# EAGLE design ReflowToasterOven (EAGLE 5.11)
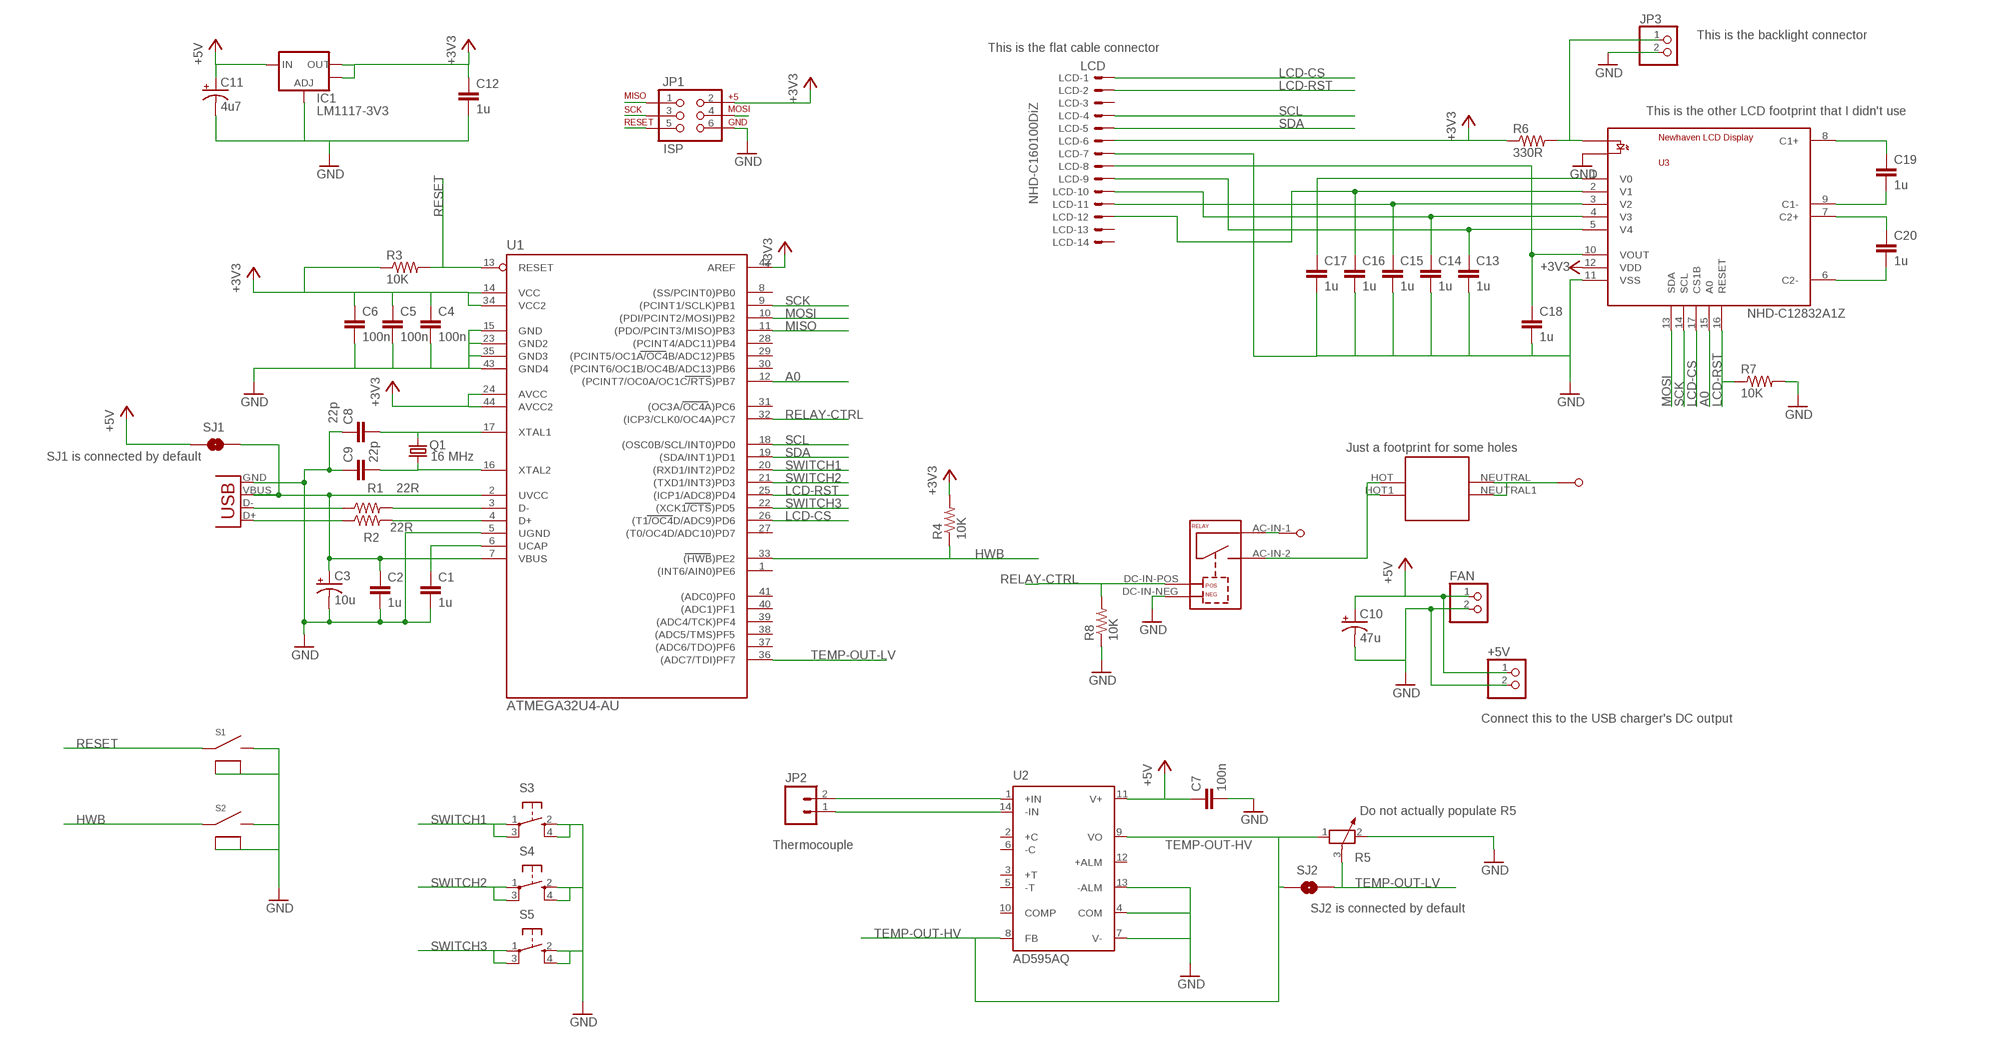
[diagram p0: schematic, sheet 1]

## Parts
+5V  PINHD-1X2  [1X02]
C1  1u  C-EUC0805  [C0805]
C2  1u  C-EUC0805  [C0805]
C3  10u  CPOL-USSMCB  [SMC_B]
C4  100n  C-EUC0805  [C0805]
C5  100n  C-EUC0805  [C0805]
C6  100n  C-EUC0805  [C0805]
C7  100n  C-EUC0805  [C0805]
C8  22p  C-EUC0805  [C0805]
C9  22p  C-EUC0805  [C0805]
C10  47u  CPOL-USD  [PANASONIC_D]
C11  4u7  CPOL-USSMCB  [SMC_B]
C12  1u  C-EUC0805  [C0805]
C13  1u  C-EUC0805  [C0805]
C14  1u  C-EUC0805  [C0805]
C15  1u  C-EUC0805  [C0805]
C16  1u  C-EUC0805  [C0805]
C17  1u  C-EUC0805  [C0805]
C18  1u  C-EUC0805  [C0805]
C19  1u  C-EUC0805  [C0805]
C20  1u  C-EUC0805  [C0805]
FAN  PINHD-1X2  [1X02]
IC1  LM1117-3V3  V_REG_LM1117SOT223  [SOT223]
JP1  ISP  AVR_SPI_PRG_6NS  [2X3-NS]
JP2  M023.5MM  [SCREWTERMINAL-3.5MM-2]
JP3  PINHD-1X2  [1X02]
LCD  LCD  52745-1490  [52745-1490]
Q1  16 MHz  CRYSTALSM49  [SM49]
R1  22R  R-US_R0805  [R0805]
R2  22R  R-US_R0805  [R0805]
R3  10K  R-US_R0805  [R0805]
R4  10K  R-US_R0805  [R0805]
R5  POTENTIOMETER_PT-10  [PT-10]
R6  330R  R-US_R0805  [R0805]
R7  10K  R-US_R0805  [R0805]
R8  10K  R-US_R0805  [R0805]
RELAY  SOLID-STATE-RELAY  [SSR]
S1  SWITCH-TACT-SIDE-1TL3330  [SWITCH-TACT-SIDE-1]
S2  SWITCH-TACT-SIDE-1TL3330  [SWITCH-TACT-SIDE-1]
S3  TAC_SWITCHSMD-7.2  [TACT-BTN-7.2MM]
S4  TAC_SWITCHSMD-7.2  [TACT-BTN-7.2MM]
S5  TAC_SWITCHSMD-7.2  [TACT-BTN-7.2MM]
SJ1  SOLDERJUMPERNO  [SJ_2S-NO]
SJ2  SOLDERJUMPERNO  [SJ_2S-NO]
U1  ATMEGA32U4-AU  [TQFP44]
U2  AD595AQ  AD595  [DIL14]
U3  NHD-LCD  [NHD-LCD]
USB  USBSMD  [USB-MINIB]
X1  PLUG-THINGY  [MINI-CHARGER]
X3  PAD  PADPTH-LARGE  [PAD-LARGE]
X5  PAD  PADPTH-LARGE  [PAD-LARGE]

## Nets
+3V3: C4.1 C5.1 C6.1 C12.1 IC1.2(OUT) IC1.4(OUT) JP1.2 LCD.6 R3.1 R4.2 R6.1 U1.14(VCC) U1.24(AVCC) U1.34(VCC2) U1.42(AREF) U1.44(AVCC2) U3.12(VDD)
+5V: +5V.1 C7.1 C10.+ C11.+ FAN.1 IC1.3(IN) SJ1.1 U2.11(V+)
A0: U1.12((PCINT7/OC0A/OC1C/RTS)PB7) U3.15(A0)
GND: +5V.2 C1.2 C2.2 C3.- C4.2 C5.2 C6.2 C7.2 C8.1 C9.1 C10.- C11.- C12.2 C13.2 C14.2 C15.2 C16.2 C17.2 C18.2 FAN.2 IC1.1(ADJ) JP1.6 JP3.2 LCD.7 R5.2 R7.2 R8.1 RELAY.DC-IN-NEG S1.2 S1.S1 S1.S2 S2.2 S2.S1 S2.S2 S3.2 S3.4 S4.2 S4.4 S5.2 S5.4 U1.5(UGND) U1.15(GND) U1.23(GND2) U1.35(GND3) U1.43(GND4) U2.4(COM) U2.7(V-) U2.13(-ALM) U3.11(VSS) U3.K(LED-K) USB.GND
HWB: R4.1 S2.1 U1.33((HWB)PE2)
LCD-CS: LCD.1 U1.26((T1/OC4D/ADC9)PD6) U3.17(CS1B)
LCD-RST: LCD.2 R7.1 U1.25((ICP1/ADC8)PD4) U3.16(RESET)
MISO: JP1.1 U1.11((PDO/PCINT3/MISO)PB3)
MOSI: JP1.4 U1.10((PDI/PCINT2/MOSI)PB2) U3.13(SDA)
N$1: R1.1 USB.D-
N$2: R2.1 USB.D+
N$3: C2.1 C3.+ SJ1.2 U1.2(UVCC) U1.7(VBUS) USB.VBUS
N$4: C1.1 U1.6(UCAP)
N$5: R1.2 U1.3(D-)
N$6: R2.2 U1.4(D+)
N$7: C8.2 Q1.2 U1.17(XTAL1)
N$8: C9.2 Q1.1 U1.16(XTAL2)
N$9: RELAY.AC-IN-2 X1.HOT X1.HOT1
N$10: JP3.1 R6.2 U3.A(LED-A)
N$11: JP2.2 U2.1(+IN)
N$12: JP2.1 U2.14(-IN)
N$13: X1.NEUTRAL X1.NEUTRAL1 X3.P$1
N$14: RELAY.AC-IN-1 X5.P$1
N$15: C17.1 U3.1(V0)
N$16: C16.1 LCD.12 U3.2(V1)
N$17: C15.1 LCD.11 U3.3(V2)
N$18: C14.1 LCD.10 U3.4(V3)
N$19: C13.1 LCD.9 U3.5(V4)
N$20: C18.1 LCD.8 U3.10(VOUT)
N$21: C19.1 U3.8(C1+)
N$22: C19.2 U3.9(C1-)
N$23: C20.1 U3.7(C2+)
N$24: C20.2 U3.6(C2-)
RELAY-CTRL: R8.2 RELAY.DC-IN-POS U1.32((ICP3/CLK0/OC4A)PC7)
RESET: JP1.5 R3.2 S1.1 U1.13(RESET)
SCK: JP1.3 U1.9((PCINT1/SCLK)PB1) U3.14(SCL)
SCL: LCD.4 U1.18((OSC0B/SCL/INT0)PD0)
SDA: LCD.5 U1.19((SDA/INT1)PD1)
SWITCH1: S3.1 S3.3 U1.20((RXD1/INT2)PD2)
SWITCH2: S4.1 S4.3 U1.21((TXD1/INT3)PD3)
SWITCH3: S5.1 S5.3 U1.22((XCK1/CTS)PD5)
TEMP-OUT-HV: R5.1 SJ2.1 U2.8(FB) U2.9(VO)
TEMP-OUT-LV: R5.3 SJ2.2 U1.36((ADC7/TDI)PF7)
Unconnected: LCD.3 LCD.13 LCD.14 U1.1((INT6/AIN0)PE6) U1.8((SS/PCINT0)PB0) U1.27((T0/OC4D/ADC10)PD7) U1.28((PCINT4/ADC11)PB4) U1.29((PCINT5/OC1A/OC4B/ADC12)PB5) U1.30((PCINT6/OC1B/OC4B/ADC13)PB6) U1.31((OC3A/OC4A)PC6) U1.37((ADC6/TDO)PF6) U1.38((ADC5/TMS)PF5) U1.39((ADC4/TCK)PF4) U1.40((ADC1)PF1) U1.41((ADC0)PF0) U2.2(+C) U2.3(+T) U2.5(-T) U2.6(-C) U2.10(COMP) U2.12(+ALM)

## Notes on the sheet
- This is the backlight connector
- This is the flat cable connector
- This is the other LCD footprint that I didn't use
- NHD-C160100DiZ
- NHD-C12832A1Z
- SJ1 is connected by default | Just a footprint for some holes
- Connect this to the USB charger's DC output
- Do not actually populate R5
- Thermocouple
- SJ2 is connected by default

## Library data of the parts
+5V FAN JP3 = pinhead:PINHD-1X2: PIN HEADER
C1 C2 C4-C9 C12-C20 = rcl:C-EU: CAPACITOR, European symbol
C3 C10 C11 = rcl:CPOL-US: POLARIZED CAPACITOR, American symbol
IC1 = SparkFun:V_REG_LM1117: Voltage Regulator LM1117 Standard adjustable voltage regulator but in SMD form. Spark Fun Electronics SKU : COM-00595
JP1 = ReflowToasterOven:AVR_SPI_PRG_6: AVR ISP 6 Pin This is the reduced ISP connector for AVR programming. Common on Arduino. This footprint will take up less PCB space and can be used with a 10-pin to 6-pin adapter such as SKU: BOB-08508
JP2 = ReflowToasterOven:M02: Header 2 Standard 2-pin 0.1" header. Use with straight break away headers (SKU : PRT-00116), right angle break away headers (PRT-00553), swiss pins (PRT-00743), machine pins (PRT-00117), and female headers (PRT-00115). Molex polarized connector foot print use with SKU : PRT-08233 with associated crimp pins and housings.
LCD = con-molex:52745-1490: FFC/FPC-to-Board 0.50mm (.020") SMT Top Contact Right Angle, ZIF, Style Receptacle 52745 / 52435 Source: http://www.molex.com/product/ffc/52745.html
Q1 = crystal:CRYSTAL: CRYSTAL
R1-R4 R6-R8 = rcl:R-US_: RESISTOR, American symbol
R5 = rcl:POTENTIOMETER_: Potentiometer
RELAY = ReflowToasterOven:SOLID-STATE-RELAY
S1 S2 = ReflowToasterOven:SWITCH-TACT-SIDE-1
S3-S5 = ReflowToasterOven:TAC_SWITCH: Momentary Switch Button commonly used for reset or general input. Spark Fun Electronics SKU : COM-00097
SJ1 SJ2 = ReflowToasterOven:SOLDERJUMPER: Solder Jumper Standard SMD solder jumper. Used to automate production. Two varients : Normally Open and Normally Closed are the same, but have different paste layers. NC will have a large amount of paste and should jumper during reflow.
U1 = ReflowToasterOven:ATMEGA32U4-AU
U2 = analog-devices:AD595: ANALOG DEVICES
U3 = ReflowToasterOven:NHD-LCD
USB = ReflowToasterOven:USB: USB Connectors USB-B-PTH is fully proven SKU : PRT-00139 USB-miniB is fully proven SKU : PRT-00587 USB-A-PCB is untested. USB-A-H is throughly reviewed, but untested. Spark Fun Electronics SKU : PRT-00437 USB-B-SMT is throughly reviewed, but untested. Needs silkscreen touching up. USB-A-S has not been used/tested USB-MB-H has not been used/tested
X1 = ReflowToasterOven:PLUG-THINGY
X3 X5 = ReflowToasterOven:PAD

## Board
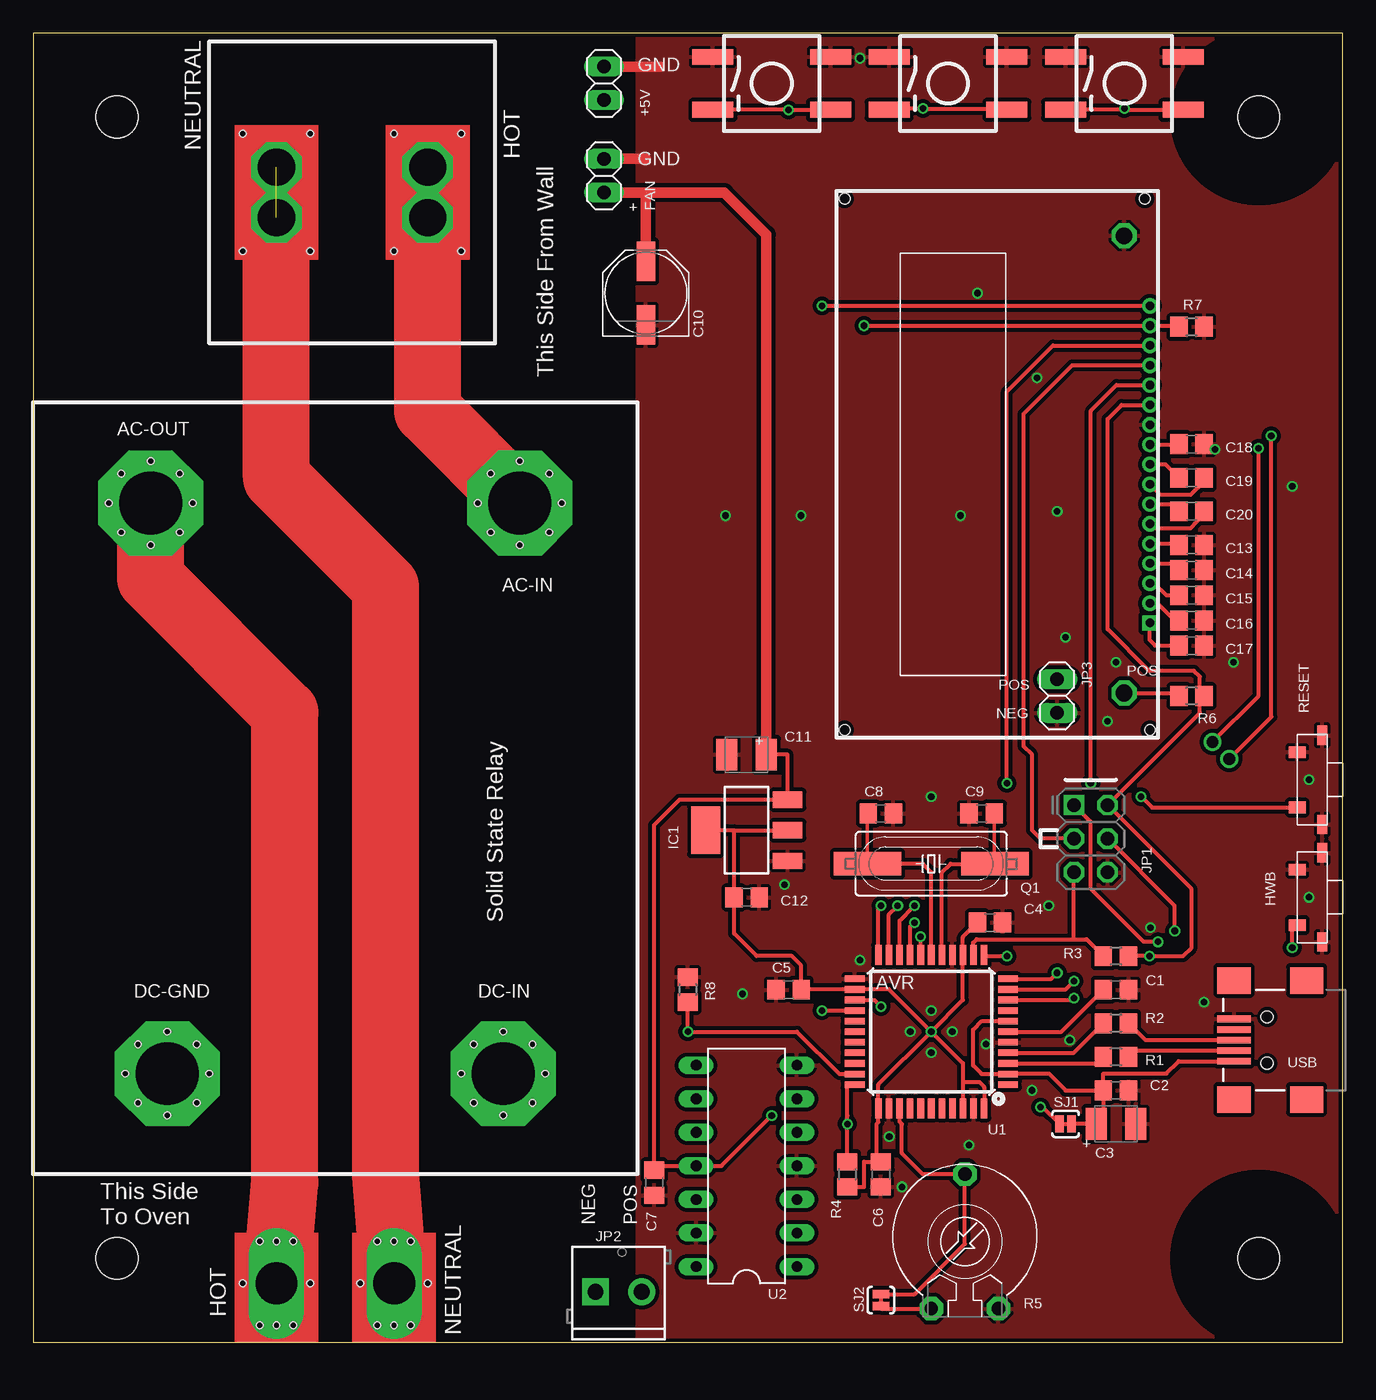
[diagram p1: board, top side]
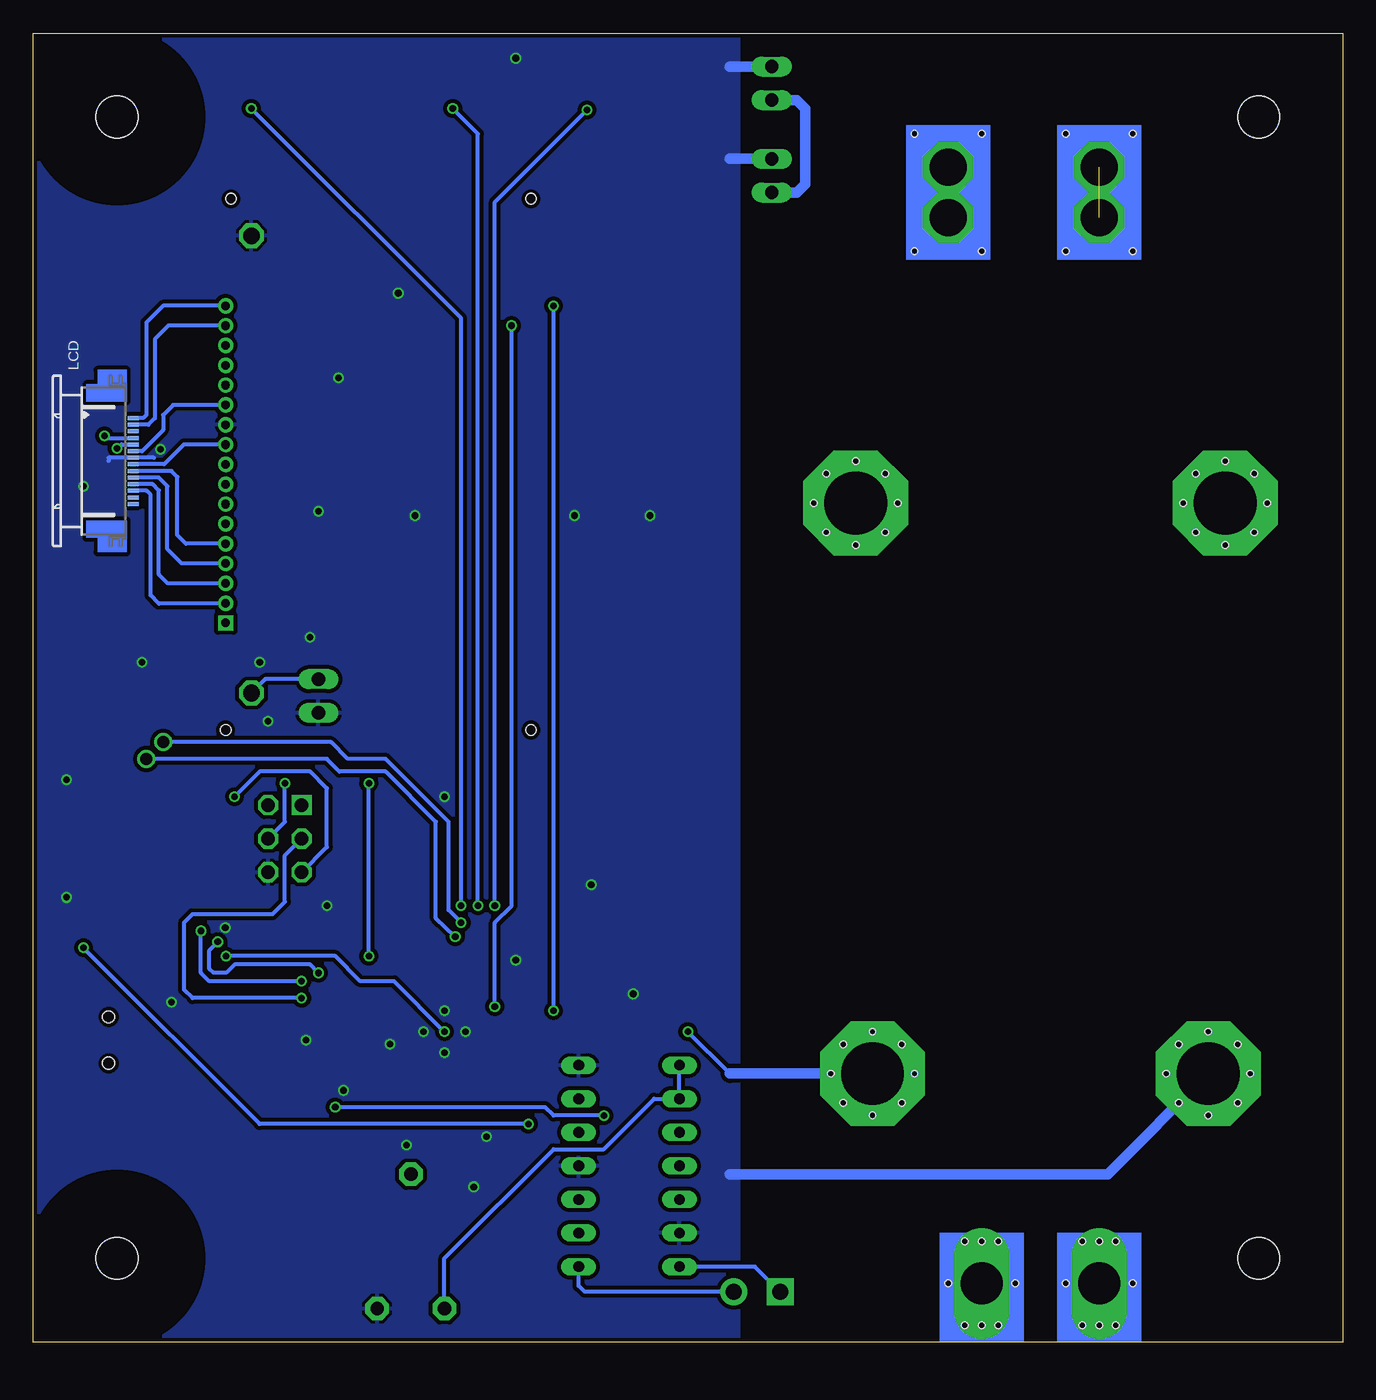
[diagram p2: board, bottom side, seen from below]

Size 99.06 x 99.06 mm. Coordinates in mm from the lower left corner, seen from the top.
Outline: 0,0 99.06,0 99.06,99.06 0,99.06 0,0
Copper layers (1*16): Top 0.035mm / dielectric 1.5mm / Bottom 0.035mm
Design rules "Fusion_eagle_rule_v1.1_TentedVias3": minimum track width 6mil, minimum drill 0.3mm, track to track 7mil, track to pad 7mil, pad to pad 7mil, via to via 7mil, smd to smd 0mil, copper to edge 10mil, drill to drill 10mil, minimum pad ring 10mil, minimum via ring 6mil, stop-mask expansion 2mil, vias tented up to drill 25mil, thermal gap 10mil
Holes 3.17 mm at 6.35,6.35 6.35,92.71 92.71,92.71 92.71,6.35
Holes 0.5 mm at 8.89,66.67 12.06,63.5 8.89,60.33 5.71,63.5 6.67,65.72 11.11,65.72 11.11,61.28 6.67,61.28 36.83,66.67 39.05,65.72 40.01,63.5 39.05,61.28 36.83,60.33 34.61,61.28 33.66,63.5 34.61,65.72 10.16,23.5 13.34,20.32 10.16,17.14 6.99,20.32 32.38,20.32 35.56,23.5 38.73,20.32 35.56,17.14 37.78,18.1 33.34,22.54 33.34,18.1 37.78,22.54 12.38,22.54 12.38,18.1 7.94,18.1 7.94,22.54 29.84,4.45 24.77,4.45 20.95,4.45 15.88,4.45
tRestrict: area 86.3,86.3 to 99.1,99.1; area 86.3,0 to 99.1,12.7
bRestrict: area 86.3,86.3 to 99.1,99.1; area 86.3,0 to 99.1,12.7

### Footprints (pad centres in the part's own frame; a part is rotated, then mirrored left to right if it is on the bottom)
1X02 = drill 1.016 long: 1 -1.27,0; 2 1.27,0
C0805 = smd 1.3 x 1.5: 1 -0.95,0; 2 0.95,0
SMC_B = smd 1.6 x 2.4: + -1.5,0; - 1.5,0
PANASONIC_D = smd 3 x 1.4: + 2.4,0; - -2.4,0
SOT223 = smd 1.219 x 2.235: 1 -2.311,-3.099; 2 0,-3.099; 3 2.311,-3.099 | smd 3.6 x 2.2: 4 0,3.099
2X3-NS = drill 1.016 square: 1 -2.54,-1.27 | drill 1.016 octagon: 2 -2.54,1.27; 3 0,-1.27; 4 0,1.27; 5 2.54,-1.27; 6 2.54,1.27
SCREWTERMINAL-3.5MM-2 = drill 1.2 pad 2.032 square: 1 0,0 | drill 1.2 pad 2.032 round: 2 3.5,0
52745-1490 = smd 0.3 x 0.8: 1 -3.25,2.5; 2 -2.75,2.5; 3 -2.25,2.5; 4 -1.75,2.5; 5 -1.25,2.5; 6 -0.75,2.5; 7 -0.25,2.5; 8 0.25,2.5; 9 0.75,2.5; 10 1.25,2.5; 11 1.75,2.5; 12 2.25,2.5; 13 2.75,2.5; 14 3.25,2.5
SM49 = smd 5.08 x 1.778: 1 -4.826,0; 2 4.826,0
R0805 = smd 1.3 x 1.5: 1 -0.95,0; 2 0.95,0
PT-10 = drill 1.016 pad 1.778 octagon: 1 -2.54,-5.08; 2 2.54,-5.08; 3 0,5.08
SSR = drill 4.762 pad 7.937 octagon: AC-IN-1 8.89,50.8; AC-IN-2 36.83,50.8; DC-IN-NEG 10.16,7.62; DC-IN-POS 35.56,7.62
SWITCH-TACT-SIDE-1 = smd 0.889 x 1.27: 1 -2.095,0.889; 2 2.095,0.889 | smd 1.448 x 0.787: S1 -3.378,-1.003; S2 3.378,-1.003
TACT-BTN-7.2MM = smd 3.1 x 1.2: 1 -4.45,2; 2 -4.45,-2; 3 4.45,2; 4 4.45,-2
SJ_2S-NO = smd 0.635 x 1.27: 1 -0.45,0; 2 0.45,0
TQFP44 = smd 1.5 x 0.5: 1 -5.8,4; 2 -5.8,3.2; 3 -5.8,2.4; 4 -5.8,1.6; 5 -5.8,0.8; 6 -5.8,0; 7 -5.8,-0.8; 8 -5.8,-1.6; 9 -5.8,-2.4; 10 -5.8,-3.2; 11 -5.8,-4; 23 5.8,-4; 24 5.8,-3.2; 25 5.8,-2.4; 26 5.8,-1.6; 27 5.8,-0.8; 28 5.8,0; 29 5.8,0.8; 30 5.8,1.6; 31 5.8,2.4; 32 5.8,3.2; 33 5.8,4 | smd 0.5 x 1.5: 12 -4,-5.8; 13 -3.2,-5.8; 14 -2.4,-5.8; 15 -1.6,-5.8; 16 -0.8,-5.8; 17 0,-5.8; 18 0.8,-5.8; 19 1.6,-5.8; 20 2.4,-5.8; 21 3.2,-5.8; 22 4,-5.8; 34 4,5.8; 35 3.2,5.8; 36 2.4,5.8; 37 1.6,5.8; 38 0.8,5.8; 39 0,5.8; 40 -0.8,5.8; 41 -1.6,5.8; 42 -2.4,5.8; 43 -3.2,5.8; 44 -4,5.8
DIL14 = drill 0.813 long: 1 -7.62,-3.81; 2 -5.08,-3.81; 3 -2.54,-3.81; 4 0,-3.81; 5 2.54,-3.81; 6 5.08,-3.81; 7 7.62,-3.81; 8 7.62,3.81; 9 5.08,3.81; 10 2.54,3.81; 11 0,3.81; 12 -2.54,3.81; 13 -5.08,3.81; 14 -7.62,3.81
NHD-LCD = drill 0.65 square: 1 8.7,0.6 | drill 0.65 round: 2 10.2,0.6; 3 11.7,0.6; 4 13.2,0.6; 5 14.7,0.6; 6 16.2,0.6; 7 17.7,0.6; 8 19.2,0.6; 9 20.7,0.6; 10 22.2,0.6; 11 23.7,0.6; 12 25.2,0.6; 13 26.7,0.6; 14 28.2,0.6; 15 29.7,0.6; 16 31.2,0.6; 17 32.7,0.6 | drill 1.25 octagon: A 3.4,2.55; K 38,2.55 | hole 0.8: 0.6,0.6; 40.8,1; 0.6,23.7; 40.8,23.7
USB-MINIB = smd 2.5 x 0.5: D+ 2.5,0; D- 2.5,0.8; GND 2.5,-1.6; ID 2.5,-0.8; VBUS 2.5,1.6 | smd 2.5 x 2: GND@1 -3,-4.5; GND@2 -3,4.5; GND@3 2.5,4.5; GND@4 2.5,-4.5 | hole 0.9: 0,1.75; 0,-1.75
MINI-CHARGER = drill 2.8 octagon: HOT -5.715,1.905; HOT1 -5.715,-1.905; NEUTRAL 5.715,1.905; NEUTRAL1 5.715,-1.905 | hole 0.5: -8.255,4.445; -3.175,4.445; -8.255,-4.445; -3.175,-4.445; 3.175,-4.445; 8.255,-4.445; 8.255,4.445; 3.175,4.445
PAD-LARGE = drill 3.175 long: P$1 0,0 | hole 0.5: -1.27,3.175; 1.27,3.175; -1.27,-3.175; 1.27,-3.175; 0,3.175; 0,-3.175

### Placement (x,y rotation side)
+5V  43.18,95.25 90 top
C1  81.92,26.67 0 top
C2  81.92,19.05 0 top
C3  81.92,16.51 0 top
C4  72.39,31.75 0 top
C5  57.15,26.67 180 top
C6  64.14,12.7 270 top
C7  46.99,12.06 270 top
C8  64.14,40.01 180 top
C9  71.75,40.01 0 top
C10  46.35,79.38 90 top
C11  53.98,44.45 180 top
C12  53.98,33.66 0 top
C13  87.63,60.33 0 top
C14  87.63,58.42 0 top
C15  87.63,56.52 0 top
C16  87.63,54.61 0 top
C17  87.63,52.7 0 top
C18  87.63,67.94 0 top
C19  87.63,65.41 180 top
C20  87.63,62.87 0 top
FAN  43.18,88.27 90 top
IC1  53.98,38.73 90 top
JP1  80.01,38.1 270 top
JP2  42.55,3.81 0 top
JP3  77.47,48.9 270 top
LCD  93.98,66.67 270 bottom
Q1  67.94,36.2 180 top
R1  81.92,21.59 180 top
R2  81.92,24.13 180 top
R3  81.92,29.21 180 top
R4  61.59,12.7 270 top
R5  70.48,7.62 0 top
R6  87.63,48.9 180 top
R7  87.63,76.83 0 top
R8  49.53,26.67 270 top
RELAY  0,12.7 0 top
S1  96.52,42.55 90 top
S2  96.52,33.66 90 top
S3  82.55,95.25 180 top
S4  69.22,95.25 180 top
S5  55.88,95.25 180 top
SJ1  78.11,16.51 0 top
SJ2  64.14,3.17 90 top
U1  67.94,23.5 180 top
U2  53.98,13.34 90 top
U3  85.09,45.72 90 top
USB  93.34,22.86 180 top
X1  24.13,87 180 top
X3  27.3,4.45 0 top
X5  18.41,4.45 0 top

### Tracks (layer width: path | path; a pad name or v marks a point on that pad's centre or on a via)
+3V3  (via drill 0.5)
  Top 0.305: C4.1 70.34,30.66 U1.14 70.34,25.89 v67.94,23.5 | R4.2 62.87,11.75 62.87,13.65 C6.1 63.95,13.65 63.82,14.29 63.82,16.51 63.95,16.64 U1.34 63.95,19.5 v67.94,23.5 | v67.94,23.5 64.75,26.7 U1.24 58.12,26.7 C5.1 58.1,28.5 57.39,29.21 54.73,29.21 53.02,30.92 C12.1 53.02,38.73 | 70.34,19.68 70.34,21.09 v67.94,23.5 | 70.34,19.68 U1.42 | 70.34,19.68 71.58,19.68 71.94,19.32 U1.44 | 53.02,38.73 IC1.4 | 53.02,38.73 IC1.2 | R3.1 v84.45,29.21 87,29.21 87.63,29.84 87.63,34.29 JP1.2 88.27,47.62 88.27,48.58 R6.1 88.27,49.21 88.27,50.35 87.82,50.8 84.43,50.8 81.28,53.95 81.28,69.85 82.35,70.92 U3.12
  Bottom 0.305: v84.45,29.21 76.2,29.21 74.3,27.3 71.75,27.3 v67.94,23.5 | LCD.6 90.81,67.42 89.22,69.02 89.22,70.17 88.47,70.92 U3.12
+5V  (via drill 0.5)
  Top 0.305: C11.+ 57.07,44.45 IC1.3 48.91,41.05 46.99,39.13 C7.1 46.99,13.34 U2.11 52.07,13.34 v55.88,17.14 | SJ1.1 76.39,17.78 v76.2,17.78
  Top 0.813: C11.+ 55.48,83.81 52.29,87 46.35,87 | 46.35,87 FAN.1 | 46.35,87 C10.+
  Bottom 0.305: v76.2,17.78 60.33,17.78 59.69,17.14 v55.88,17.14
  Bottom 0.813: FAN.1 41.27,87 40.64,87.63 40.64,93.34 41.27,93.98 +5V.1
A0  (via drill 0.5)
  Top 0.305: U1.12 72.03,29.21 v73.66,29.21 | v73.66,42.29 73.66,71.93 77.15,75.42 U3.15
  Bottom 0.305: v73.66,29.21 v73.66,42.29
GND  (via drill 0.5)
  Top 0.813: +5V.2 47.4,96.52 | FAN.2 46.35,89.53
  Bottom 0.305: 93.34,66.67 93.34,66.92 LCD.7 | LCD.7 91.57,66.93 | 89.92,66.93 LCD.7
  Bottom 0.813: RELAY.DC-IN-NEG 17.78,12.7 46.35,12.7 | +5V.2 46.35,96.52 | FAN.2 46.35,89.53
  other vias: 72.07,22.54 88.58,25.72 67.94,21.91 69.53,23.5 67.94,25.08 66.36,23.5 67.94,41.27 65.72,11.75 96.52,42.55 96.52,33.66 70.17,62.55 53.66,26.35 56.83,34.61 70.8,14.92 75.56,19.05 58.1,62.55 52.39,62.55 71.44,79.38 62.55,97.16 64.77,15.56 62.55,28.89 95.25,64.77 77.47,62.87 75.95,72.96 90.81,51.44 81.92,51.44 78.11,53.34 81.28,46.99 76.83,33.02 84.52,31.37 78.42,22.86 89.41,67.56
  pour Bottom (isolate 0.305): 45.72,99.06 45.72,0 99.06,0 99.06,99.06
  pour Top (isolate 0.305): 45.72,0 99.06,0 99.06,99.06 45.72,99.06
HWB  (via drill 0.5)
  Top 0.305: R4.1 v61.59,16.51 61.59,17.14 61.59,19.5 U1.33 | S2.1 95.25,31.18 v95.25,29.84
  Bottom 0.305: v95.25,29.84 81.92,16.51 v61.59,16.51
LCD-CS  (via drill 0.5)
  Top 0.305: v59.69,78.42 U3.17 | v59.69,25.09 U1.26
  Bottom 0.305: LCD.1 90.73,69.92 90.49,70.17 90.49,77.15 89.22,78.42 U3.17 | v59.69,25.09 v59.69,78.42
LCD-RST  (via drill 0.5)
  Top 0.305: R7.1 86.59,76.92 U3.16 v62.87,76.92 | U1.25 63.64,25.89 v64.14,25.4
  Bottom 0.305: v62.87,76.92 62.87,33.02 64.14,31.75 v64.14,25.4 | LCD.2 90.34,69.42 89.85,69.91 89.85,75.88 88.81,76.92 U3.16
MISO  (via drill 0.5)
  Top 0.305: U1.11 77.03,27.5 v77.47,27.94 | v85.09,30.29 84.01,30.29 80.01,34.29 80.01,39.37 JP1.1
  Bottom 0.305: v77.47,27.94 78.11,28.57 83.82,28.57 84.45,27.94 85.41,27.94 85.72,28.26 85.72,29.65 v85.09,30.29
MOSI  (via drill 0.5)
  Top 0.305: U1.10 78.13,26.7 v78.74,27.3 | v86.36,31.11 86.36,33.02 JP1.4 | v80.01,42.29 80.01,70.48 81.94,72.42 U3.13
  Bottom 0.305: v78.74,27.3 85.72,27.3 86.36,27.94 v86.36,31.11 | JP1.4 80.01,39.37 v80.01,42.29
N$1
  Top 0.305: R1.1 83.33,22.06 USB.D-
N$2
  Top 0.305: R2.1 84.14,22.86 USB.D+
N$3
  Top 0.305: U1.7 71.78,24.3 71.12,23.64 71.12,20.93 71.75,20.3 U1.2 73.77,20.32 76.83,20.32 78.11,19.05 C2.1 | USB.VBUS 86.67,21.26 85.72,20.32 80.97,20.32 C2.1 | C2.1 80.97,17.06 C3.+ SJ1.2
N$4
  Top 0.305: C1.1 77.79,23.5 U1.6
N$5
  Top 0.305: R1.2 80.47,21.09 U1.3
N$6
  Top 0.305: R2.2 78.73,21.89 U1.4
N$7
  Top 0.254: C8.2 63.12,40.01 Q1.2
  Top 0.305: U1.17 67.94,35.56 67.31,36.2 Q1.2
N$8
  Top 0.254: C9.2 72.7,36.26 Q1.1
  Top 0.305: U1.16 68.75,35.54 69.4,36.2 Q1.1
N$9
  Top 5.08: X1.HOT 29.84,70.48 RELAY.AC-IN-2
  Top 6.35: X1.HOT X1.HOT1
N$10
  Top 0.305: U3.A 86.68,49.12 R6.2
  Bottom 0.305: U3.A 81.5,50.16 JP3.1
N$11
  Bottom 0.305: JP2.2 57.34,3.81 57.78,4.26 U2.1
N$12
  Bottom 0.305: U2.14 44.45,5.71 JP2.1
N$13  (1 unrouted)
  Top 5.08: X1.NEUTRAL 18.41,65.41 26.67,57.15 26.67,12.7 X3.P$1
N$14
  Top 5.08: RELAY.AC-IN-1 8.89,57.78 19.05,47.62 19.05,12.06 X5.P$1
N$15
  Top 0.305: C17.1 84.88,52.7 84.45,53.13 84.45,54.38 U3.1
N$16
  Top 0.305: C16.1 86.36,54.61 85.09,55.88 84.53,55.88 U3.2
  Bottom 0.305: LCD.12 90.46,64.42 90.17,64.14 90.17,56.52 89.53,55.88 84.53,55.88 U3.2
N$17
  Top 0.305: C15.1 85.72,56.52 84.82,57.42 U3.3
  Bottom 0.305: LCD.11 90.01,64.92 89.53,64.45 89.53,58.1 88.85,57.42 U3.3
N$18
  Top 0.305: C14.1 86.18,58.92 U3.4
  Bottom 0.305: U3.4 87.81,58.92 88.9,60.01 88.9,64.77 89.56,65.42 LCD.10
N$19
  Top 0.305: C13.1 86.58,60.42 U3.5
  Bottom 0.305: LCD.9 88.59,65.92 88.14,65.47 88.14,61.04 88.05,60.96 87.5,60.42 U3.5
N$20
  Top 0.305: C18.1 86.66,67.92 U3.10
  Bottom 0.305: LCD.8 89.15,66.42 87.66,67.92 U3.10
N$21
  Top 0.305: C19.1 88.58,65.08 88.52,65.02 87.56,64.14 85.28,64.14 U3.8
N$22
  Top 0.305: C19.2 85.67,66.42 U3.9
N$23
  Top 0.305: C20.1 86.12,63.42 U3.7
N$24
  Top 0.305: C20.2 88.58,62.67 88.52,62.61 87.56,61.59 84.81,61.59 U3.6
N$25
  Top 0.305: 64.14,3.56 64.14,2.79
N$26
  Top 0.305: 77.72,16.51 78.36,16.51
RELAY-CTRL  (via drill 0.5)
  Top 0.305: U1.32 60.98,20.3 57.78,23.5 v49.53,23.5 R8.2
  Bottom 0.305: 46.35,20.32 v49.53,23.5
  Bottom 0.813: RELAY.DC-IN-POS 46.35,20.32
RESET  (via drill 0.5)
  Top 0.305: U1.13 71.12,29.32 71.12,30.23 71.37,30.48 78.74,30.48 | 78.74,30.48 79.69,30.48 R3.2 | 78.74,30.48 JP1.5 | S1.1 84.64,40.45 v83.82,41.27
  Bottom 0.305: v83.82,41.27 81.92,43.18 78.11,43.18 76.83,41.91 76.83,37.47 JP1.5
SCK  (via drill 0.5)
  Top 0.305: U1.9 78.74,25.89 v78.74,26.04 | U3.14 78.59,73.92 74.93,70.26 74.93,45.09 75.56,44.45 75.56,41.91 75.56,38.73 76.2,38.1 JP1.3
  Bottom 0.305: v78.74,26.04 87,26.04 87.63,26.67 87.63,31.75 87,32.38 80.94,32.38 80.01,33.32 80.01,36.83 JP1.3
SCL  (via drill 0.5, 0.9)
  Top 0.305: v93.66,68.58 93.66,47.31 v90.49,44.13 | v67.12,30.67 67.14,30.63 U1.18
  Bottom 0.305: LCD.4 93.51,68.42 v93.66,68.58 | v90.49,44.13 76.83,44.13 75.88,43.18 72.39,43.18 68.58,39.37 68.58,32.07 v67.12,30.67
SDA  (via drill 0.5, 0.9)
  Top 0.305: U1.19 66.34,31.42 v66.67,31.75 | v89.22,45.4 92.71,48.9 v92.71,67.63
  Bottom 0.305: v66.67,31.75 67.63,32.7 67.63,39.37 72.39,44.13 75.25,44.13 76.52,45.4 v89.22,45.4 | v92.71,67.63 92.37,67.92 LCD.5
SWITCH1  (via drill 0.5)
  Top 0.305: U1.20 65.55,31.89 v66.67,33.02 | 82.55,93.25 S3.3 | 82.55,93.25 S3.1 | v82.55,93.34 82.55,93.25
  Bottom 0.305: v66.67,33.02 66.67,77.47 v82.55,93.34
SWITCH2  (via drill 0.5)
  Top 0.305: S4.3 64.86,93.34 v67.31,93.34 73.57,93.34 S4.1 | U1.21 64.75,32.36 v65.41,33.02
  Bottom 0.305: v65.41,33.02 65.41,91.44 v67.31,93.34
SWITCH3  (via drill 0.5)
  Top 0.305: S5.1 v57.15,93.25 S5.3 | U1.22 63.95,32.83 v64.14,33.02
  Bottom 0.305: v64.14,33.02 64.14,86.27 v57.15,93.25
TEMP-OUT-HV
  Top 0.305: SJ2.1 64.14,2.54 R5.1
  Bottom 0.305: U2.8 U2.9 52.07,18.41 55.88,14.61 59.69,14.61 67.94,6.35 R5.1
TEMP-OUT-LV
  Top 0.305: U1.36 65.55,16.69 65.72,16.51 65.72,14.29 67.31,12.7 R5.3 70.48,7.43 66.68,3.62 SJ2.2
(copper drawn outside any net)
  shapes: Bottom area x2, Top area x2

### Text on the board
tPlace: AVR
tNames: GND | NEUTRAL | HOT | GND | This Side From Wall | AC-OUT | AC-IN | NEG | Solid State Relay | DC-GND | DC-IN | This Side | To Oven | NEUTRAL | HOT
_tsilk: + | POS | POS | RESET | + | HWB | + | NEG | POS